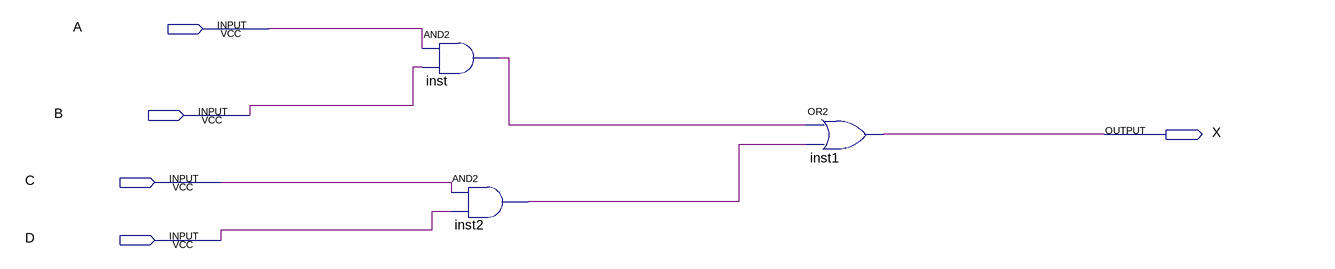
[diagram p0: schematic sheet]
// Quartus schematic first.bdf as structural Verilog: 3 symbols, 5 pins
module first (
  input  A,
  input  B,
  input  C,
  input  D,
  output X
);

  wire inst2_out, inst_out;

  and inst (inst_out, A, B);
  and inst2 (inst2_out, C, D);
  or inst1 (X, inst_out, inst2_out);
endmodule
